# Altium schematic sheet ui_cpu.SchDoc: mcHF Pro Transceiver UI board
size A3; Author: Krassi Atanassov; CompanyName: MØNKA; Engineer: For radio amateurs experimentation, non-commercial use only. Thank you!; Revision: 0.8.5; SheetTotal: 13
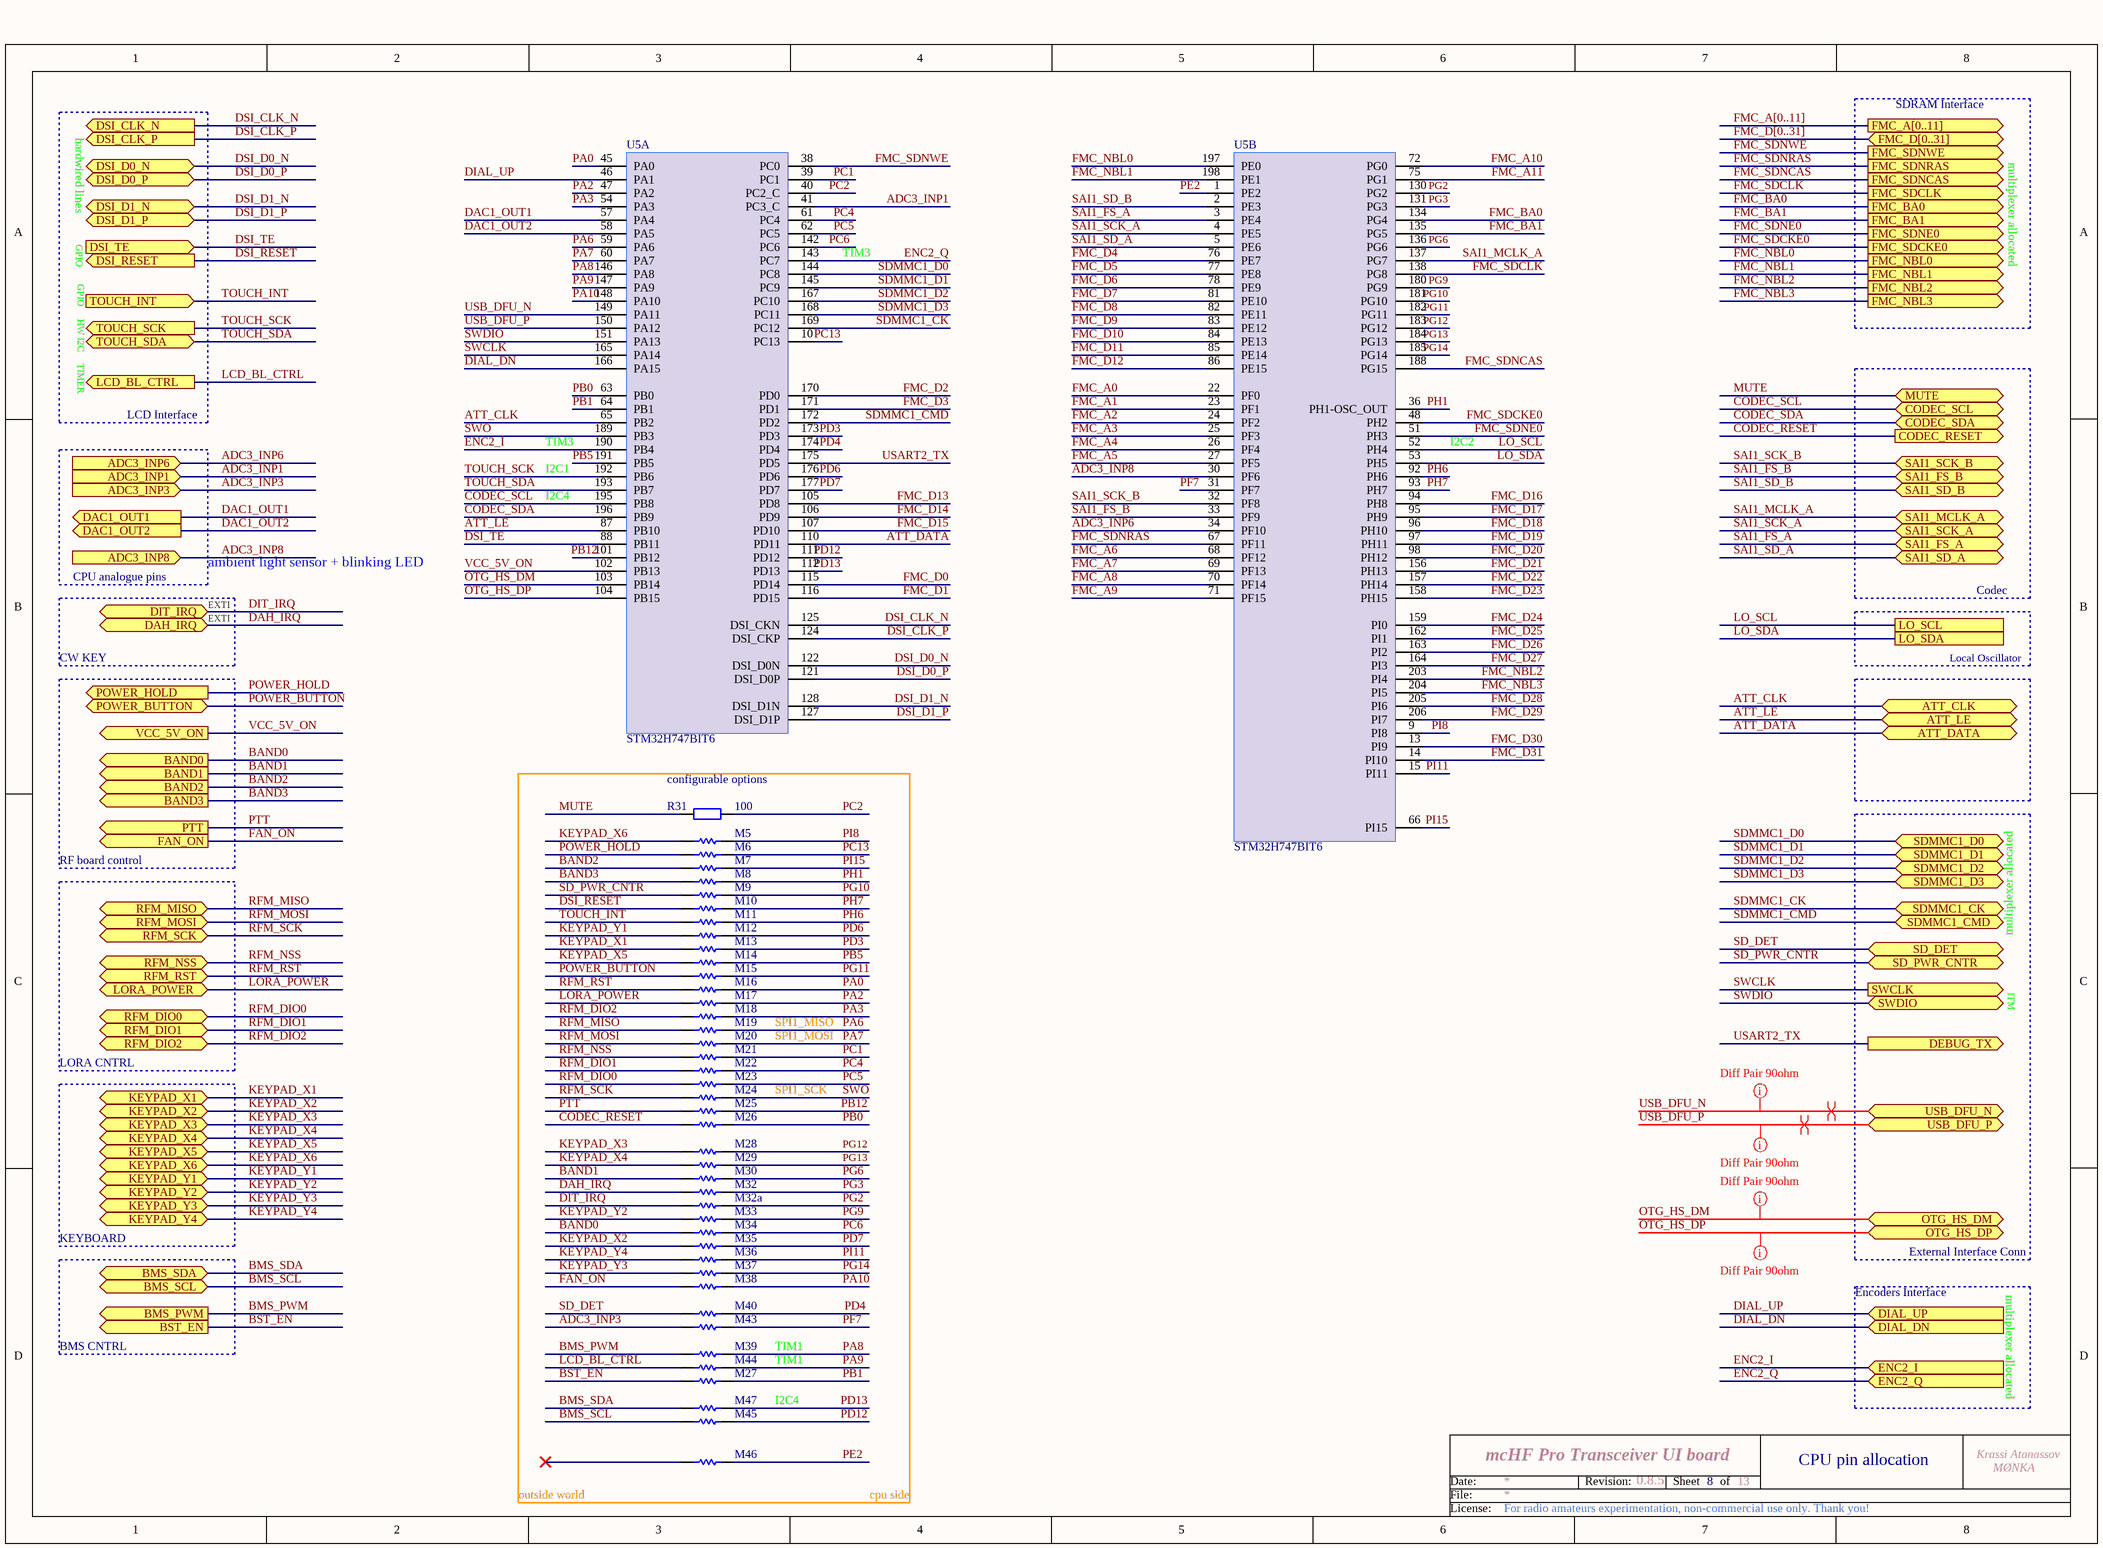
[diagram p0: ui_cpu.SchDoc]

## Parts
M5  0  [SB_0603]  (value not drawn)  (net tie, no BOM)
M6  0  [SB_0603]  (value not drawn)  (net tie, no BOM)
M7  0  [SB_0603]  (value not drawn)  (net tie, no BOM)
M8  0  [SB_0603]  (value not drawn)  (net tie, no BOM)
M9  0  [SB_0603]  (value not drawn)  (net tie, no BOM)
M10  0  [SB_0603]  (value not drawn)  (net tie, no BOM)
M11  0  [SB_0603]  (value not drawn)  (net tie, no BOM)
M12  0  [SB_0603]  (value not drawn)  (net tie, no BOM)
M13  0  [SB_0603]  (value not drawn)  (net tie, no BOM)
M14  0  [SB_0603]  (value not drawn)  (net tie, no BOM)
M15  0  [SB_0603]  (value not drawn)  (net tie, no BOM)
M16  0  [SB_0603]  (value not drawn)  (net tie, no BOM)
M17  0  [SB_0603]  (value not drawn)  (net tie, no BOM)
M18  0  [SB_0603]  (value not drawn)  (net tie, no BOM)
M19  0  [SB_0603]  (value not drawn)  (net tie, no BOM)
M20  0  [SB_0603]  (value not drawn)  (net tie, no BOM)
M21  0  [SB_0603]  (value not drawn)  (net tie, no BOM)
M22  0  [SB_0603]  (value not drawn)  (net tie, no BOM)
M23  0  [SB_0603]  (value not drawn)  (net tie, no BOM)
M24  0  [SB_0603]  (value not drawn)  (net tie, no BOM)
M25  0  [SB_0603]  (value not drawn)  (net tie, no BOM)
M26  0  [SB_0603]  (value not drawn)  (net tie, no BOM)
M27  0  [SB_0603]  (value not drawn)  (net tie, no BOM)
M28  0  [SB_0603]  (value not drawn)  (net tie, no BOM)
M29  0  [SB_0603]  (value not drawn)  (net tie, no BOM)
M30  0  [SB_0603]  (value not drawn)  (net tie, no BOM)
M32  0  [SB_0603]  (value not drawn)  (net tie, no BOM)
M32a  0  [SB_0603]  (value not drawn)  (net tie, no BOM)
M33  0  [SB_0603]  (value not drawn)  (net tie, no BOM)
M34  0  [SB_0603]  (value not drawn)  (net tie, no BOM)
M35  0  [SB_0603]  (value not drawn)  (net tie, no BOM)
M36  0  [SB_0603]  (value not drawn)  (net tie, no BOM)
M37  0  [SB_0603]  (value not drawn)  (net tie, no BOM)
M38  0  [SB_0603]  (value not drawn)  (net tie, no BOM)
M39  0  [SB_0603]  (value not drawn)  (net tie, no BOM)
M40  0  [SB_0603]  (value not drawn)  (net tie, no BOM)
M43  0  [SB_0603]  (value not drawn)  (net tie, no BOM)
M44  0  [SB_0603]  (value not drawn)  (net tie, no BOM)
M45  0  [SB_0603]  (value not drawn)  (net tie, no BOM)
M46  0  [SB_0603]  (value not drawn)  (net tie, no BOM)
M47  0  [SB_0603]  (value not drawn)  (net tie, no BOM)
R31  100  [0805]
U5  STM32H747BIT6  [LQFP208-28x28x1.4]  (parts A,B of 3)

## Ports
ADC3_INP1 (in), ADC3_INP3 (in), ADC3_INP6 (in), ADC3_INP8 (in), ATT_CLK (bidir), ATT_DATA (bidir), ATT_LE (bidir), BAND0 (out), BAND1 (out), BAND2 (out), BAND3 (out), BMS_PWM (out), BMS_SCL (bidir), BMS_SDA (bidir), BST_EN (out), CODEC_RESET (out), CODEC_SCL (bidir), CODEC_SDA (bidir), DAC1_OUT1 (out), DAC1_OUT2 (out), DAH_IRQ (bidir), DEBUG_TX (out), DIAL_DN (in), DIAL_UP (in), DIT_IRQ (bidir), DSI_CLK_N (out), DSI_CLK_P (out), DSI_D0_N (bidir), DSI_D0_P (bidir), DSI_D1_N (bidir), DSI_D1_P (bidir), DSI_RESET (out), DSI_TE (in), ENC2_I (in), ENC2_Q (in), FAN_ON (out), FMC_A[0..11] (out), FMC_BA0 (out), FMC_BA1 (out), FMC_D[0..31] (bidir), FMC_NBL0 (out), FMC_NBL1 (out), FMC_NBL2 (out), FMC_NBL3 (out), FMC_SDCKE0 (out), FMC_SDCLK (out), FMC_SDNCAS (out), FMC_SDNE0 (out), FMC_SDNRAS (out), FMC_SDNWE (out), KEYPAD_X1 (bidir), KEYPAD_X2 (bidir), KEYPAD_X3 (bidir), KEYPAD_X4 (bidir), KEYPAD_X5 (bidir), KEYPAD_X6 (bidir), KEYPAD_Y1 (bidir), KEYPAD_Y2 (bidir), KEYPAD_Y3 (bidir), KEYPAD_Y4 (bidir), LCD_BL_CTRL (out), LO_SCL, LO_SDA, LORA_POWER (bidir), MUTE (bidir), OTG_HS_DM (bidir), OTG_HS_DP (bidir), POWER_BUTTON (bidir), POWER_HOLD (out), PTT (out), RFM_DIO0 (bidir), RFM_DIO1 (bidir), RFM_DIO2 (bidir), RFM_MISO (bidir), RFM_MOSI (bidir), RFM_NSS (bidir), RFM_RST (bidir), RFM_SCK (bidir), SAI1_FS_A (bidir), SAI1_FS_B (bidir), SAI1_MCLK_A (bidir), SAI1_SCK_A (bidir), SAI1_SCK_B (bidir), SAI1_SD_A (bidir), SAI1_SD_B (bidir), SD_DET (bidir), SD_PWR_CNTR (bidir), SDMMC1_CK (bidir), SDMMC1_CMD (bidir), SDMMC1_D0 (bidir), SDMMC1_D1 (bidir), SDMMC1_D2 (bidir), SDMMC1_D3 (bidir), SWCLK (out), SWDIO (bidir), TOUCH_INT (in), TOUCH_SCK (out), TOUCH_SDA (bidir), USB_DFU_N (bidir), USB_DFU_P (bidir), VCC_5V_ON (out)

## Nets
ADC3_INP1: U5.41(PC3_C) ; port ADC3_INP1
ADC3_INP3: M43.1 ; port ADC3_INP3
ADC3_INP6: U5.34(PF10) ; port ADC3_INP6
ADC3_INP8: U5.30(PF6) ; port ADC3_INP8
ATT_CLK: U5.65(PB2) ; port ATT_CLK
ATT_DATA: U5.110(PD11) ; port ATT_DATA
ATT_LE: U5.87(PB10) ; port ATT_LE
BAND0: M34.1 ; port BAND0
BAND1: M30.1 ; port BAND1
BAND2: M7.1 ; port BAND2
BAND3: M8.1 ; port BAND3
BMS_PWM: M39.1 ; port BMS_PWM
BMS_SCL: M45.1 ; port BMS_SCL
BMS_SDA: M47.1 ; port BMS_SDA
BST_EN: M27.1 ; port BST_EN
CODEC_RESET: M26.1 ; port CODEC_RESET
CODEC_SCL: U5.195(PB8) ; port CODEC_SCL
CODEC_SDA: U5.196(PB9) ; port CODEC_SDA
DAC1_OUT1: U5.57(PA4) ; port DAC1_OUT1
DAC1_OUT2: U5.58(PA5) ; port DAC1_OUT2
DAH_IRQ: M32.1 ; port DAH_IRQ
DIAL_DN: U5.166(PA15) ; port DIAL_DN
DIAL_UP: U5.46(PA1) ; port DIAL_UP
DIT_IRQ: M32a.1 ; port DIT_IRQ
DSI_CLK_N: U5.125(DSI_CKN) ; port DSI_CLK_N
DSI_CLK_P: U5.124(DSI_CKP) ; port DSI_CLK_P
DSI_D0_N: U5.122(DSI_D0N) ; port DSI_D0_N
DSI_D0_P: U5.121(DSI_D0P) ; port DSI_D0_P
DSI_D1_N: U5.128(DSI_D1N) ; port DSI_D1_N
DSI_D1_P: U5.127(DSI_D1P) ; port DSI_D1_P
DSI_RESET: M10.1 ; port DSI_RESET
DSI_TE: U5.88(PB11) ; port DSI_TE
ENC2_I: U5.190(PB4) ; port ENC2_I
ENC2_Q: U5.143(PC7) ; port ENC2_Q
FAN_ON: M38.1 ; port FAN_ON
FMC_A0: U5.22(PF0)
FMC_A1: U5.23(PF1)
FMC_A2: U5.24(PF2)
FMC_A3: U5.25(PF3)
FMC_A4: U5.26(PF4)
FMC_A5: U5.27(PF5)
FMC_A6: U5.68(PF12)
FMC_A7: U5.69(PF13)
FMC_A8: U5.70(PF14)
FMC_A9: U5.71(PF15)
FMC_A10: U5.72(PG0)
FMC_A11: U5.75(PG1)
FMC_BA0: U5.134(PG4) ; port FMC_BA0
FMC_BA1: U5.135(PG5) ; port FMC_BA1
FMC_D0: U5.115(PD14)
FMC_D1: U5.116(PD15)
FMC_D2: U5.170(PD0)
FMC_D3: U5.171(PD1)
FMC_D4: U5.76(PE7)
FMC_D5: U5.77(PE8)
FMC_D6: U5.78(PE9)
FMC_D7: U5.81(PE10)
FMC_D8: U5.82(PE11)
FMC_D9: U5.83(PE12)
FMC_D10: U5.84(PE13)
FMC_D11: U5.85(PE14)
FMC_D12: U5.86(PE15)
FMC_D13: U5.105(PD8)
FMC_D14: U5.106(PD9)
FMC_D15: U5.107(PD10)
FMC_D16: U5.94(PH8)
FMC_D17: U5.95(PH9)
FMC_D18: U5.96(PH10)
FMC_D19: U5.97(PH11)
FMC_D20: U5.98(PH12)
FMC_D21: U5.156(PH13)
FMC_D22: U5.157(PH14)
FMC_D23: U5.158(PH15)
FMC_D24: U5.159(PI0)
FMC_D25: U5.162(PI1)
FMC_D26: U5.163(PI2)
FMC_D27: U5.164(PI3)
FMC_D28: U5.205(PI6)
FMC_D29: U5.206(PI7)
FMC_D30: U5.13(PI9)
FMC_D31: U5.14(PI10)
FMC_NBL0: U5.197(PE0) ; port FMC_NBL0
FMC_NBL1: U5.198(PE1) ; port FMC_NBL1
FMC_NBL2: U5.203(PI4) ; port FMC_NBL2
FMC_NBL3: U5.204(PI5) ; port FMC_NBL3
FMC_SDCKE0: U5.48(PH2) ; port FMC_SDCKE0
FMC_SDCLK: U5.138(PG8) ; port FMC_SDCLK
FMC_SDNCAS: U5.188(PG15) ; port FMC_SDNCAS
FMC_SDNE0: U5.51(PH3) ; port FMC_SDNE0
FMC_SDNRAS: U5.67(PF11) ; port FMC_SDNRAS
FMC_SDNWE: U5.38(PC0) ; port FMC_SDNWE
KEYPAD_X1: M13.1 ; port KEYPAD_X1
KEYPAD_X2: M35.1 ; port KEYPAD_X2
KEYPAD_X3: M28.1 ; port KEYPAD_X3
KEYPAD_X4: M29.1 ; port KEYPAD_X4
KEYPAD_X5: M14.1 ; port KEYPAD_X5
KEYPAD_X6: M5.1 ; port KEYPAD_X6
KEYPAD_Y1: M12.1 ; port KEYPAD_Y1
KEYPAD_Y2: M33.1 ; port KEYPAD_Y2
KEYPAD_Y3: M37.1 ; port KEYPAD_Y3
KEYPAD_Y4: M36.1 ; port KEYPAD_Y4
LCD_BL_CTRL: M44.1 ; port LCD_BL_CTRL
LO_SCL: U5.52(PH4) ; port LO_SCL
LO_SDA: U5.53(PH5) ; port LO_SDA
LORA_POWER: M17.1 ; port LORA_POWER
MUTE: R31.2 ; port MUTE
OTG_HS_DM: U5.103(PB14) ; port OTG_HS_DM
OTG_HS_DP: U5.104(PB15) ; port OTG_HS_DP
PA0: M16.2 U5.45(PA0)
PA2: M17.2 U5.47(PA2)
PA3: M18.2 U5.54(PA3)
PA6: M19.2 U5.59(PA6)
PA7: M20.2 U5.60(PA7)
PA8: M39.2 U5.146(PA8)
PA9: M44.2 U5.147(PA9)
PA10: M38.2 U5.148(PA10)
PB0: M26.2 U5.63(PB0)
PB1: M27.2 U5.64(PB1)
PB5: M14.2 U5.191(PB5)
PB12: M25.2 U5.101(PB12)
PC1: M21.2 U5.39(PC1)
PC2: R31.1 U5.40(PC2_C)
PC4: M22.2 U5.61(PC4)
PC5: M23.2 U5.62(PC5)
PC6: M34.2 U5.142(PC6)
PC13: M6.2 U5.10(PC13)
PD3: M13.2 U5.173(PD3)
PD4: M40.2 U5.174(PD4)
PD6: M12.2 U5.176(PD6)
PD7: M35.2 U5.177(PD7)
PD12: M45.2 U5.111(PD12)
PD13: M47.2 U5.112(PD13)
PE2: M46.2 U5.1(PE2)
PF7: M43.2 U5.31(PF7)
PG2: M32a.2 U5.130(PG2)
PG3: M32.2 U5.131(PG3)
PG6: M30.2 U5.136(PG6)
PG9: M33.2 U5.180(PG9)
PG10: M9.2 U5.181(PG10)
PG11: M15.2 U5.182(PG11)
PG12: M28.2 U5.183(PG12)
PG13: M29.2 U5.184(PG13)
PG14: M37.2 U5.185(PG14)
PH1: M8.2 U5.36(PH1-OSC_OUT)
PH6: M11.2 U5.92(PH6)
PH7: M10.2 U5.93(PH7)
PI8: M5.2 U5.9(PI8)
PI11: M36.2 U5.15(PI11)
PI15: M7.2 U5.66(PI15)
POWER_BUTTON: M15.1 ; port POWER_BUTTON
POWER_HOLD: M6.1 ; port POWER_HOLD
PTT: M25.1 ; port PTT
RFM_DIO0: M23.1 ; port RFM_DIO0
RFM_DIO1: M22.1 ; port RFM_DIO1
RFM_DIO2: M18.1 ; port RFM_DIO2
RFM_MISO: M19.1 ; port RFM_MISO
RFM_MOSI: M20.1 ; port RFM_MOSI
RFM_NSS: M21.1 ; port RFM_NSS
RFM_RST: M16.1 ; port RFM_RST
RFM_SCK: M24.1 ; port RFM_SCK
SAI1_FS_A: U5.3(PE4) ; port SAI1_FS_A
SAI1_FS_B: U5.33(PF9) ; port SAI1_FS_B
SAI1_MCLK_A: U5.137(PG7) ; port SAI1_MCLK_A
SAI1_SCK_A: U5.4(PE5) ; port SAI1_SCK_A
SAI1_SCK_B: U5.32(PF8) ; port SAI1_SCK_B
SAI1_SD_A: U5.5(PE6) ; port SAI1_SD_A
SAI1_SD_B: U5.2(PE3) ; port SAI1_SD_B
SD_DET: M40.1 ; port SD_DET
SD_PWR_CNTR: M9.1 ; port SD_PWR_CNTR
SDMMC1_CK: U5.169(PC12) ; port SDMMC1_CK
SDMMC1_CMD: U5.172(PD2) ; port SDMMC1_CMD
SDMMC1_D0: U5.144(PC8) ; port SDMMC1_D0
SDMMC1_D1: U5.145(PC9) ; port SDMMC1_D1
SDMMC1_D2: U5.167(PC10) ; port SDMMC1_D2
SDMMC1_D3: U5.168(PC11) ; port SDMMC1_D3
SWCLK: U5.165(PA14) ; port SWCLK
SWDIO: U5.151(PA13) ; port SWDIO
SWO: M24.2 U5.189(PB3)
TOUCH_INT: M11.1 ; port TOUCH_INT
TOUCH_SCK: U5.192(PB6) ; port TOUCH_SCK
TOUCH_SDA: U5.193(PB7) ; port TOUCH_SDA
USART2_TX: U5.175(PD5) ; port DEBUG_TX
USB_DFU_N: U5.149(PA11) ; port USB_DFU_N
USB_DFU_P: U5.150(PA12) ; port USB_DFU_P
VCC_5V_ON: U5.102(PB13) ; port VCC_5V_ON

Not connected (* = marked no-connect by the designer): M46 1*

## Buses and harness runs
bus FMC_A[0..11] = port FMC_A[0..11]
bus FMC_D[0..31] = port FMC_D[0..31]

## Layout directives
differential pair: USB_DFU_N, USB_DFU_P
rule Matched Net Lengths [Tolerance = 300mil]: OTG_HS_DM, OTG_HS_DP, USB_DFU_N, USB_DFU_P

## Notes on the sheet
- hardwired lines
- SDRAM Interface
- multiplexer allocated
- GPIO
- TIM3
- HW I2C
- TIMER
- LCD Interface
- I2C1
- I2C2
- I2C4
- CPU analogue pins
- EXTI
- ambient light sensor + blinking LED
- Codec
- CW KEY
- Local Oscillator
- (near R31) configurable options
- RF board control
- SPI1_MISO
- ITM
- LORA CNTRL
- SPI1_SCK
- SPI1_MOSI
- KEYBOARD
- Encoders Interface
- External Interface Conn
- BMS CNTRL
- TIM1
- outside world
- cpu side
- 8
- CPU pin allocation
- Date:
- File:
- Revision:
- Sheet
- of
- License:

## Library data of the parts
M5-M30 M32 M32a M33-M40 M43-M47 = Link: Value: 1K; Published: 8-Jun-2000; Revision: July-2002: Re-released for DXP Platform.; Publisher: Altium Limited
R31 = RES: Resistor; Order: FN 933-2375; QT Order: QCR-00301; Price: 0.027
U5 = STM32H747BIT6: STM32H747BIT6 LQFP208; Order: FN 248-4976; Price: 10.97